# EAGLE schematic eepromer (EAGLE 6.5.0)
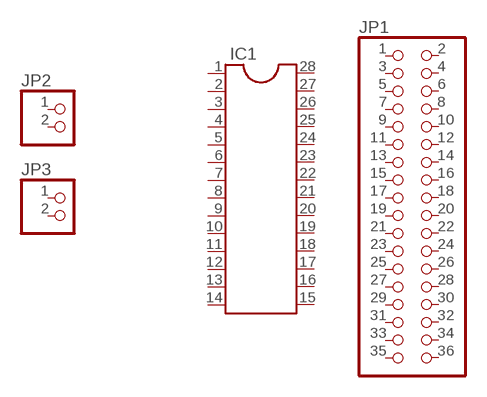
[diagram p0: schematic, sheet 1]

## Parts
IC1  DIL28  [DIL28-6]
JP1  PINHD-2X18  [2X18]
JP2  PINHD-1X2  [1X02]
JP3  PINHD-1X2  [1X02]
Unconnected: IC1.1 IC1.2 IC1.3 IC1.4 IC1.5 IC1.6 IC1.7 IC1.8 IC1.9 IC1.10 IC1.11 IC1.12 IC1.13 IC1.14 IC1.15 IC1.16 IC1.17 IC1.18 IC1.19 IC1.20 IC1.21 IC1.22 IC1.23 IC1.24 IC1.25 IC1.26 IC1.27 IC1.28 JP1.1 JP1.2 JP1.3 JP1.4 JP1.5 JP1.6 JP1.7 JP1.8 JP1.9 JP1.10 JP1.11 JP1.12 JP1.13 JP1.14 JP1.15 JP1.16 JP1.17 JP1.18 JP1.19 JP1.20 JP1.21 JP1.22 JP1.23 JP1.24 JP1.25 JP1.26 JP1.27 JP1.28 JP1.29 JP1.30 JP1.31 JP1.32 JP1.33 JP1.34 JP1.35 JP1.36 JP2.1 JP2.2 JP3.1 JP3.2

## Library data of the parts
IC1 = ic-package:DIL28: Dual In Line
JP1 = pinhead:PINHD-2X18: PIN HEADER
JP2 JP3 = pinhead:PINHD-1X2: PIN HEADER